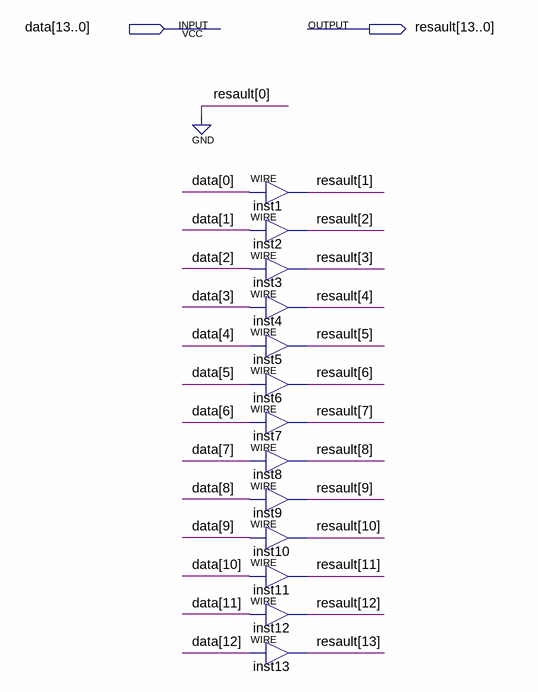
[diagram p0: schematic sheet]
// Quartus schematic ALD_SLL.bdf as structural Verilog: 13 symbols, 2 pins
module ALD_SLL (
  input  [13:0] data,
  output [13:0] resault
);

  assign resault[1] = data[0];  // WIRE inst1
  assign resault[2] = data[1];  // WIRE inst2
  assign resault[3] = data[2];  // WIRE inst3
  assign resault[4] = data[3];  // WIRE inst4
  assign resault[5] = data[4];  // WIRE inst5
  assign resault[6] = data[5];  // WIRE inst6
  assign resault[7] = data[6];  // WIRE inst7
  assign resault[8] = data[7];  // WIRE inst8
  assign resault[9] = data[8];  // WIRE inst9
  assign resault[10] = data[9];  // WIRE inst10
  assign resault[11] = data[10];  // WIRE inst11
  assign resault[12] = data[11];  // WIRE inst12
  assign resault[13] = data[12];  // WIRE inst13

  assign resault[0] = 1'b0;
endmodule
